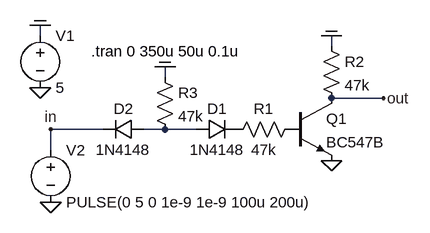
[diagram p0: schematic dtl2.asc]
dtl2.asc, the LTspice schematic file:
Version 4
SHEET 1 880 680
WIRE -112 32 -112 16
WIRE 336 48 336 32
WIRE 80 96 80 80
WIRE 416 128 336 128
WIRE -16 176 -96 176
WIRE 80 176 48 176
WIRE 128 176 80 176
WIRE -96 208 -96 176
FLAG -112 112 0
FLAG -112 16 COM
FLAG 336 224 0
FLAG -96 288 0
FLAG 336 32 COM
FLAG 416 128 out
FLAG -96 176 in
FLAG 80 80 COM
SYMBOL voltage -112 16 R0
WINDOW 123 0 0 Left 2
WINDOW 39 0 0 Left 2
SYMATTR InstName V1
SYMATTR Value 5
SYMBOL diode 128 192 R270
WINDOW 0 32 32 VTop 2
WINDOW 3 0 32 VBottom 2
SYMATTR InstName D1
SYMATTR Value 1N4148
SYMBOL res 288 160 R90
WINDOW 0 0 56 VBottom 2
WINDOW 3 32 56 VTop 2
SYMATTR InstName R1
SYMATTR Value 47k
SYMBOL npn 272 128 R0
SYMATTR InstName Q1
SYMATTR Value BC547B
SYMBOL res 320 32 R0
SYMATTR InstName R2
SYMATTR Value 47k
SYMBOL voltage -96 192 R0
WINDOW 123 0 0 Left 2
WINDOW 39 0 0 Left 2
SYMATTR InstName V2
SYMATTR Value PULSE(0 5 0 1e-9 1e-9 100u 200u)
SYMBOL diode 48 160 R90
WINDOW 0 0 32 VBottom 2
WINDOW 3 32 32 VTop 2
SYMATTR InstName D2
SYMATTR Value 1N4148
SYMBOL res 64 80 R0
SYMATTR InstName R3
SYMATTR Value 47k
TEXT -34 56 Left 2 !.tran 0 350u 50u 0.1u

The netlist it stands for:
* dtl2.asc
V1 COM 0 5
D1 N001 P001 1N4148
R1 P002 P001 47k
Q1 out P002 0 0 BC547B
R2 COM out 47k
V2 in 0 PULSE(0 5 0 1e-9 1e-9 100u 200u)
D2 N001 in 1N4148
R3 COM N001 47k
.model D D
.lib standard.dio
.model NPN NPN
.model PNP PNP
.lib standard.bjt
.tran 0 350u 50u 0.1u
.backanno
.end